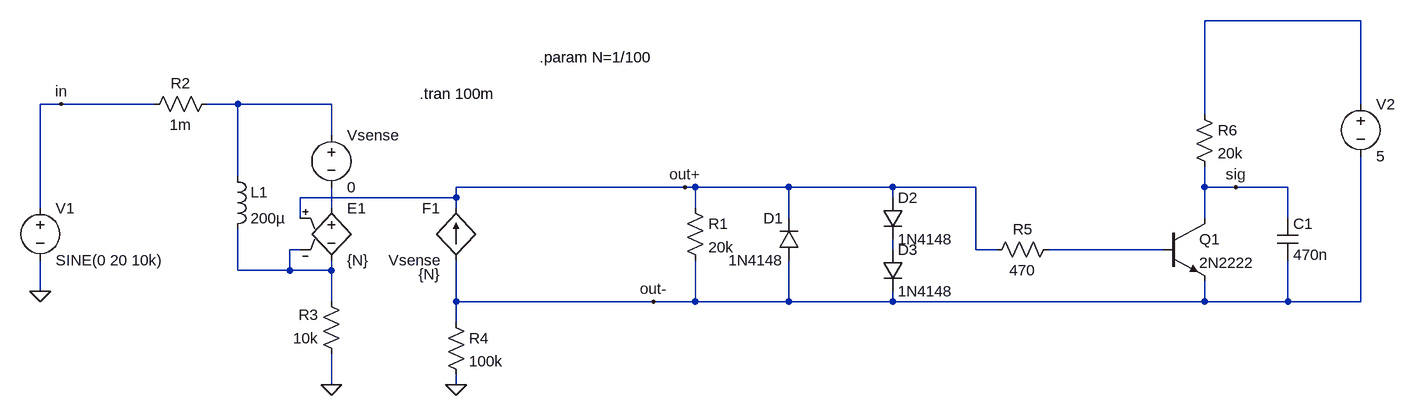
[diagram p0: schematic CurrentSense.asc]
CurrentSense.asc, the LTspice schematic file:
Version 4
SHEET 1 1788 680
WIRE 1728 -32 1488 -32
WIRE -272 96 -304 96
WIRE -128 96 -272 96
WIRE 0 96 -48 96
WIRE 144 96 0 96
WIRE 1728 96 1728 -32
WIRE 1488 112 1488 -32
WIRE 144 144 144 96
WIRE 0 208 0 96
WIRE 688 224 336 224
WIRE 704 224 688 224
WIRE 848 224 704 224
WIRE 1008 224 848 224
WIRE 1136 224 1008 224
WIRE 1488 224 1488 192
WIRE 1536 224 1488 224
WIRE 1616 224 1536 224
WIRE 336 240 336 224
WIRE 336 240 96 240
WIRE 1008 240 1008 224
WIRE -304 256 -304 96
WIRE 144 256 144 224
WIRE 336 256 336 240
WIRE 704 256 704 224
WIRE 96 272 96 240
WIRE 848 272 848 224
WIRE 1488 272 1488 224
WIRE 1616 272 1616 224
WIRE 96 320 80 320
WIRE 1008 320 1008 304
WIRE 1136 320 1136 224
WIRE 1168 320 1136 320
WIRE 1424 320 1248 320
WIRE 0 352 0 288
WIRE 80 352 80 320
WIRE 80 352 0 352
WIRE 144 352 144 336
WIRE 144 352 80 352
WIRE -304 384 -304 336
WIRE 144 400 144 352
WIRE 336 400 336 336
WIRE 640 400 336 400
WIRE 704 400 704 336
WIRE 704 400 640 400
WIRE 848 400 848 336
WIRE 848 400 704 400
WIRE 1008 400 1008 384
WIRE 1008 400 848 400
WIRE 1488 400 1488 368
WIRE 1488 400 1008 400
WIRE 1616 400 1616 336
WIRE 1616 400 1488 400
WIRE 1728 400 1728 176
WIRE 1728 400 1616 400
WIRE 336 432 336 400
WIRE 144 528 144 480
WIRE 336 528 336 512
FLAG -304 384 0
FLAG 144 528 0
FLAG 336 528 0
FLAG 688 224 out+
FLAG -272 96 in
FLAG 640 400 out-
FLAG 1536 224 sig
SYMBOL e 144 240 R0
SYMATTR InstName E1
SYMATTR Value {N}
SYMBOL f 336 336 R180
WINDOW 0 24 80 Left 2
WINDOW 3 24 0 Left 2
WINDOW 123 24 -22 Left 2
SYMATTR InstName F1
SYMATTR Value Vsense
SYMATTR Value2 {N}
SYMBOL voltage 144 128 R0
SYMATTR InstName Vsense
SYMATTR Value 0
SYMBOL voltage -304 240 R0
SYMATTR InstName V1
SYMATTR Value SINE(0 20 10k)
SYMBOL Res 688 240 R0
SYMATTR InstName R1
SYMATTR Value 20k
SYMBOL Res -32 80 R90
WINDOW 0 0 56 VBottom 2
WINDOW 3 32 56 VTop 2
SYMATTR InstName R2
SYMATTR Value 1m
SYMBOL Res 160 496 R180
WINDOW 0 36 76 Left 2
WINDOW 3 36 40 Left 2
SYMATTR InstName R3
SYMATTR Value 10k
SYMBOL Res 320 416 R0
SYMATTR InstName R4
SYMATTR Value 100k
SYMBOL diode 864 336 R180
WINDOW 0 24 64 Left 2
WINDOW 3 24 0 Left 2
SYMATTR InstName D1
SYMATTR Value 1N4148
SYMBOL diode 992 240 R0
SYMATTR InstName D2
SYMATTR Value 1N4148
SYMBOL diode 992 320 R0
SYMATTR InstName D3
SYMATTR Value 1N4148
SYMBOL npn 1424 272 R0
SYMATTR InstName Q1
SYMATTR Value 2N2222
SYMBOL cap 1600 272 R0
SYMATTR InstName C1
SYMATTR Value 470n
SYMBOL Res 1264 304 R90
WINDOW 0 0 56 VBottom 2
WINDOW 3 32 56 VTop 2
SYMATTR InstName R5
SYMATTR Value 470
SYMBOL voltage 1728 80 R0
SYMATTR InstName V2
SYMATTR Value 5
SYMBOL Res 1472 96 R0
SYMATTR InstName R6
SYMATTR Value 20k
SYMBOL ind -16 192 R0
SYMATTR InstName L1
SYMATTR Value 200µ
TEXT 280 80 Left 2 !.tran 100m
TEXT 464 24 Left 2 !.param N=1/100

The netlist it stands for:
* CurrentSense.asc
E1 N003 N004 out+ N004 {N}
F1 out- out+ Vsense {N}
Vsense N002 N003 0
V1 in 0 SINE(0 20 10k)
R1 out+ out- 20k
R2 N002 in 1m
R3 0 N004 10k
R4 out- 0 100k
D1 out- out+ 1N4148
D2 out+ N005 1N4148
D3 N005 out- 1N4148
Q1 sig N006 out- 0 2N2222
C1 sig out- 470n
R5 N006 out+ 470
V2 N001 out- 5
R6 N001 sig 20k
L1 N002 N004 200µ
.model D D
.lib standard.dio
.model NPN NPN
.model PNP PNP
.lib standard.bjt
.tran 100m
.param N=1/100
.backanno
.end